# Altium project Power_Board_2.PrjPcb (part 4 of 4)

## Sheet External_Connections.SchDoc
size A4; SheetNumber: 10
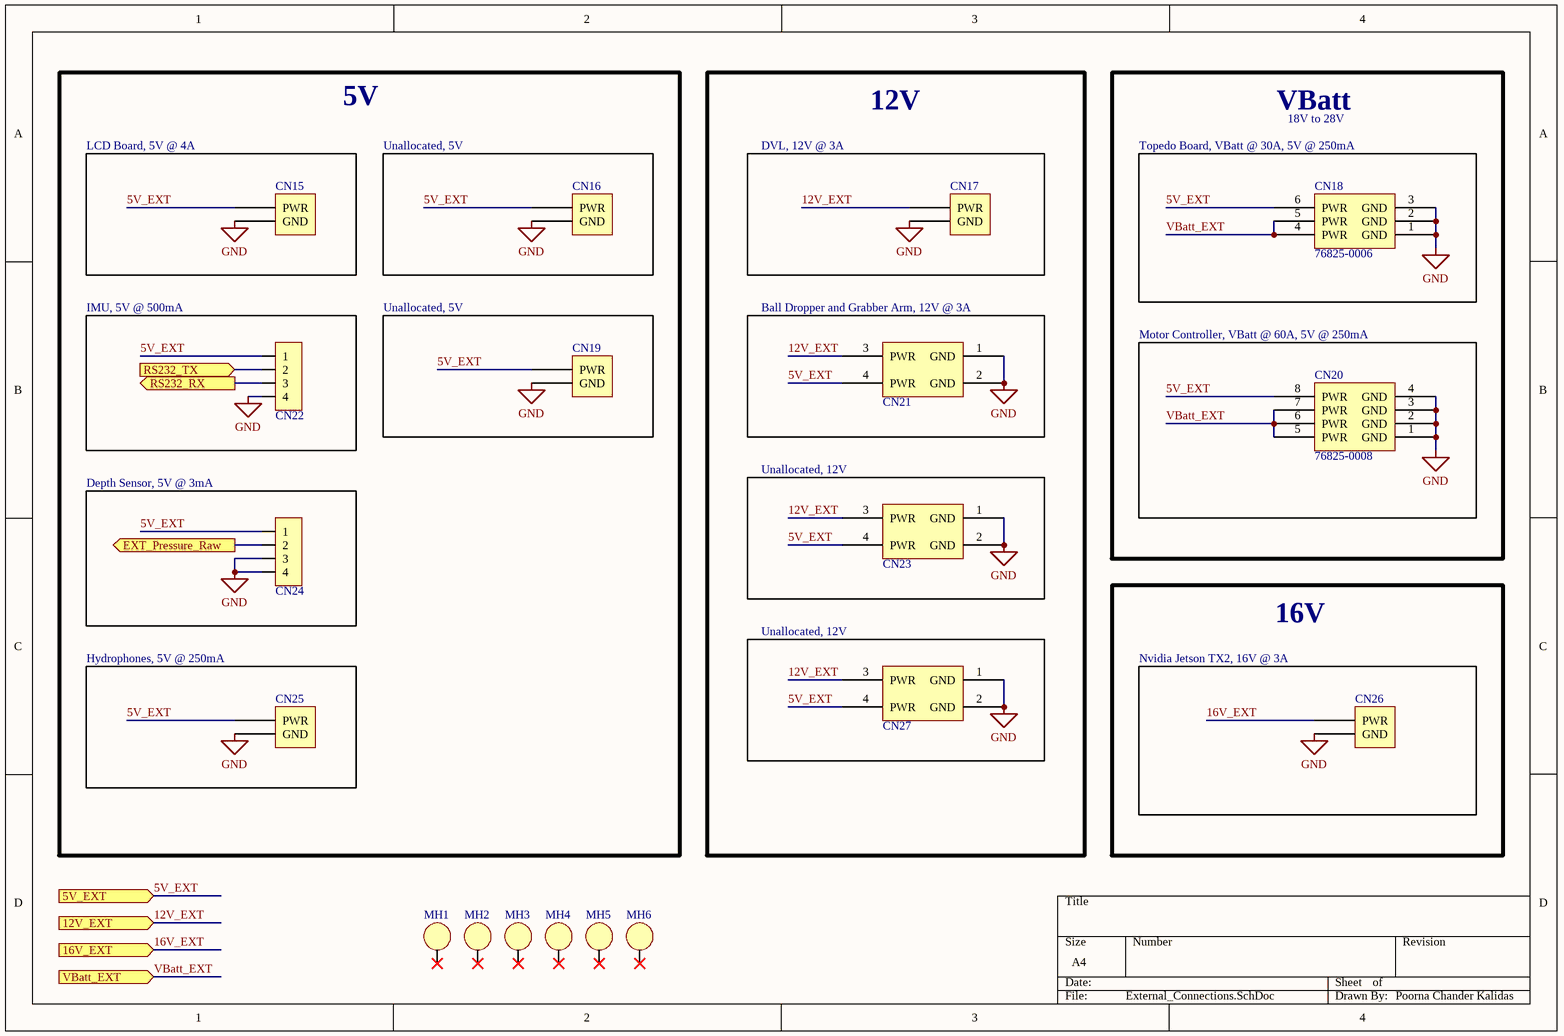
[diagram p9: External_Connections.SchDoc]

### Parts
CN15  Header, Female, 1x2, Right Angle, Pitch 0.118" (3.00mm), THT  [New footprint 1]  (value not drawn)
CN16  Header, Female, 1x2, Right Angle, Pitch 0.118" (3.00mm), THT  [New footprint 1]  (value not drawn)
CN17  Header, Female, 1x2, Right Angle, Pitch 0.118" (3.00mm), THT  [New footprint 1]  (value not drawn)
CN18  76825-0006  [76825-0006-Footprint-1]
CN19  Header, Female, 1x2, Right Angle, Pitch 0.118" (3.00mm), THT  [New footprint 1]  (value not drawn)
CN20  76825-0008  [76825-0008-Footprint-1]
CN21  Header, Female, 2x2, RIght Angle, Pitch: 0.118"  (3.00mm), THT  [2x2 Pitch 118mil connector]  (value not drawn)
CN22  Header, Male, 1x4, RA, Pitch 0.1" (2.54mm)  [HEADER, MALE, SHROUDED, 4x1, PITCH 0.1" (2.54mm), RA]  (value not drawn)
CN23  Header, Female, 2x2, RIght Angle, Pitch: 0.118"  (3.00mm), THT  [2x2 Pitch 118mil connector]  (value not drawn)
CN24  Header, Male, 1x4, RA, Pitch 0.1" (2.54mm)  [HEADER, MALE, SHROUDED, 4x1, PITCH 0.1" (2.54mm), RA]  (value not drawn)
CN25  Header, Female, 1x2, Right Angle, Pitch 0.118" (3.00mm), THT  [New footprint 1]  (value not drawn)
CN26  Header, Female, 1x2, Right Angle, Pitch 0.118" (3.00mm), THT  [New footprint 1]  (value not drawn)
CN27  Header, Female, 2x2, RIght Angle, Pitch: 0.118"  (3.00mm), THT  [2x2 Pitch 118mil connector]  (value not drawn)
MH1  Mount_Hole_3mm  [Mount-Hole_3mm]  (value not drawn)
MH2  Mount_Hole_3mm  [Mount-Hole_3mm]  (value not drawn)
MH3  Mount_Hole_3mm  [Mount-Hole_3mm]  (value not drawn)
MH4  Mount_Hole_3mm  [Mount-Hole_3mm]  (value not drawn)
MH5  Mount_Hole_3mm  [Mount-Hole_3mm]  (value not drawn)
MH6  Mount_Hole_3mm  [Mount-Hole_3mm]  (value not drawn)

### Blocks framed on the sheet
LCD Board, 5V @ 4A: CN15
Unallocated, 5V: CN16
DVL, 12V @ 3A: CN17
Topedo Board, VBatt @ 30A, 5V @ 250mA: CN18
IMU, 5V @ 500mA: CN22
Unallocated, 5V: CN19
Ball Dropper and Grabber Arm, 12V @ 3A: CN21
Motor Controller, VBatt @ 60A, 5V @ 250mA: CN20
Depth Sensor, 5V @ 3mA: CN24
Unallocated, 12V: CN23
Hydrophones, 5V @ 250mA: CN25
Unallocated, 12V: CN27
Nvidia Jetson TX2, 16V @ 3A: CN26

### Ports
5V_EXT (in), 12V_EXT (in), 16V_EXT (in), EXT_Pressure_Raw (out), RS232_RX (out), RS232_TX (in), VBatt_EXT (in)

### Nets
GND: CN15.1(GND) CN16.1(GND) CN17.1(GND) CN18.1(GND) CN18.2(GND) CN18.3(GND) CN19.1(GND) CN20.1(GND) CN20.2(GND) CN20.3(GND) CN20.4(GND) CN21.1(GND) CN21.2(GND) CN22.4 CN23.1(GND) CN23.2(GND) CN24.3 CN24.4 CN25.1(GND) CN26.1(GND) CN27.1(GND) CN27.2(GND)
5V_EXT: CN15.2(PWR) CN16.2(PWR) CN18.6(PWR) CN19.2(PWR) CN20.8(PWR) CN21.4(PWR) CN22.1 CN23.4(PWR) CN24.1 CN25.2(PWR) CN27.4(PWR) ; port 5V_EXT
12V_EXT: CN17.2(PWR) CN21.3(PWR) CN23.3(PWR) CN27.3(PWR) ; port 12V_EXT
16V_EXT: CN26.2(PWR) ; port 16V_EXT
EXT_Pressure_Raw: CN24.2 ; port EXT_Pressure_Raw
RS232_RX: CN22.3 ; port RS232_RX
RS232_TX: CN22.2 ; port RS232_TX
VBatt_EXT: CN18.4(PWR) CN18.5(PWR) CN20.5(PWR) CN20.6(PWR) CN20.7(PWR) ; port VBatt_EXT

Not connected (* = marked no-connect by the designer): MH1 1*; MH2 1*; MH3 1*; MH4 1*; MH5 1*; MH6 1*

### Notes on the sheet
- 5V
- 12V
- VBatt
- 18V to 28V
- 16V
- Poorna Chander Kalidas

### Library data of the parts
CN15-CN17 CN19 CN25 CN26 = CMP-00001-4: Connector Header Through Hole, Right Angle 2 position; Gender: Male; Max Voltage Rating (DC): 250.25kV; Number of Contacts: 2; Current Rating: 5A; Glow Wire Compliant: Compliant; Voltage Rating: 600V; Voltage Rating (DC): 250V; Insulation Resistance: 1GR; Pitch: 3mm; Contact Resistance: 10mR; Length: 7.15mm; Contact Material: Brass; Housing Color: Black; Contact Plating: Gold; Packaging: Tray; Mount: Through Hole; Diameter: 3mm; Housing Material: Thermoplastic; Case/Package: SMC; Depth: 12.2mm; Termination: Solder; Color: Black; Max Current Rating: 5A; Number of Positions: 2; Lead Free: Contains Lead; Min Operating Temperature: -40°C; Number of Rows: 2; Height: 8.77mm; Package Quantity: 3168; Number of Circuits: 2; Max Operating Temperature: 105°C; Radiation Hardening: No; Flammability Rating: UL94 V-0; Orientation: Right Angle; Halogen Free: Low Halogen
CN18 = CMP-00049-2: CONNECTOR, HEADER, 6POS, 2ROW, 5.7MM; Product Range:Mega-Fit 76825 Series; Contact Termination Type:Through Hole; Gender:Header; No. of Contacts:6; Pitch Spacing:5.7mm; Contact Plating:Tin Plated Contacts; Contact Material:Copper; Number of Circuits: 6; Gender: Male; Mount: Through Hole; Color: Black; Number of Rows: 2; Contact Material: Copper; Termination: Through Hole; Orientation: Right Angle; Number of Pins: 6; Pitch: 5.7mm; REACH SVHC: Unknown; Contact Plating: Tin; Number of Contacts: 6
CN20 = CMP-00051-3: MOLEX         76825-0008.             CONNECTOR, HEADER, 8POS, 2ROW, 5.7MM; Number of Circuits: 8; Gender: Male; Color: Black; Contact Material: Copper; Pitch: 5.7mm; Number of Rows: 2; Mount: Through Hole; Number of Contacts: 8; Number of Pins: 8; Orientation: Right Angle; Contact Plating: Tin; REACH SVHC: Unknown; Termination: Through Hole
CN21 CN23 CN27 = CMP-005-0021-4: Connector Header Through Hole, Right Angle 4 position 0.118" (3.00mm); Design Item ID: Header, Female, 2x2, RIght Angle, Pitch: 0.118"  (3.00mm), THT; Publisher: AUVic; Component Type: Standard; Created By: Poorna Chander Kalidas; Source: AUVic_Schematic_Library_Connectors.SchLib; Date Published: 2020-05-16; Pin Count: 4
CN22 CN24 = CMP-005-0029-3: Connector Header Through Hole, Right Angle 4 position 0.100" (2.54mm); Source: AUVic_Schematic_Library_Connectors.SchLib; Created On: 2020-05-20; Pin Count: 4; Component Type: Standard; Design Item ID: Header, Male, 1x4, RA, Pitch 0.1" (2.54mm); Created By: Miguel Manguerra
MH1-MH6 = CMP-004-0010-4: Mounting hold for M3 hex standoff; Source: AUVic_Schematic_Library_Connectors.SchLib; Design Item ID: Mount_Hole_3mm; Component Type: Standard; Pin Count: 1

## Nets that join several sheets
3V3: Battery_Management (7 pins), 5V_12V_External (6 pins), Micro (23 pins), Power_Internal (C57.2 R85.2 U14.2), Sensors (7 pins), Reed_Switch (5 pins), Communications (5 pins), 16V_VBatt_External (7 pins)
5V_INT: Micro (D17.K), Power_Internal (8 pins), Communications (C73.1 C74.1 U17.3)
GND: Battery_Management (33 pins), 5V_12V_External (45 pins), Micro (29 pins), Power_Internal (13 pins), Sensors (7 pins), Reed_Switch (19 pins), Communications (10 pins), 16V_VBatt_External (23 pins), External_Connections (22 pins)
Motor_PWR: Battery_Management (7 pins), Power_Internal (D10.A), 16V_VBatt_External (C52.1 Q7.5 Q8.5 U12.1)
System_PWR: Battery_Management (5 pins), 5V_12V_External (14 pins), Power_Internal (D9.A), 16V_VBatt_External (5 pins)
VBatt_INT: Battery_Management (C7.1 U4.1), Power_Internal (5 pins), Reed_Switch (CN11.1 Q10.2 SW2.4)
5V_EXT: 5V_12V_External (R45.1 R50.1 U6.8), External_Connections (11 pins)
12V_EXT: 5V_12V_External (R56.1 R61.1 U8.8), External_Connections (CN17.2 CN21.3 CN23.3 CN27.3)
16V_Enable: Micro (U16.12), 16V_VBatt_External (R71.2 U9.3)
16V_EXT: 16V_VBatt_External (R67.1 R70.1 U10.8), External_Connections (CN26.2)
ADC_Bat0_1: Battery_Management (R9.1 R19.2), Micro (U15.25)
ADC_Bat0_2: Battery_Management (R10.2 R20.2), Micro (U15.24)
ADC_Bat0_3: Battery_Management (R11.1 R21.2), Micro (U15.23)
ADC_Bat0_4: Battery_Management (R12.1 R22.1), Micro (U15.22)
ADC_Bat0_5: Battery_Management (R13.1 R23.2), Micro (U15.21)
ADC_Bat0_6: Battery_Management (R14.1 R24.2), Micro (U15.20)
ADC_Bat1_1: Battery_Management (R31.2 R37.2), Micro (U15.17)
ADC_Bat1_2: Battery_Management (R32.2 R38.2), Micro (U15.16)
ADC_Bat1_3: Battery_Management (R33.1 R39.2), Micro (U15.15)
ADC_Bat1_4: Battery_Management (R34.1 R40.1), Micro (U15.14)
ADC_Bat1_5: Battery_Management (R35.1 R41.2), Micro (U15.11)
ADC_Bat1_6: Battery_Management (R36.1 R42.2), Micro (U15.10)
CAN_RX: Micro (U15.61), Communications (JP2.2 R101.2)
CAN_TX: Micro (U15.62), Communications (JP2.1 R99.2)
EXT_Pressure_Raw: Sensors (R104.2), External_Connections (CN24.2)
I2C_SCL: Battery_Management (U1.2 U1.5 U2.5 U3.5), 5V_12V_External (U6.2 U6.5 U8.5), Micro (JP1.1 R95.1 U15.41), Sensors (U18.8 U19.6), 16V_VBatt_External (U10.5 U11.5)
I2C_SDA: Battery_Management (U1.4 U2.4 U3.2 U3.4), 5V_12V_External (U6.4 U8.2 U8.4), Micro (JP1.2 R96.1 U15.40), Sensors (U18.7 U19.1), 16V_VBatt_External (U10.4 U11.4)
NetC12_2: 5V_12V_External (C12.2 R44.2 U5.3), Micro (U16.14)
NetC29_2: 5V_12V_External (C29.2 R55.2 U7.3), Micro (U16.13)
NetCN7_2: Micro (U15.9), Sensors (CN7.2 R102.1)
NetD18_A: Micro (U15.8), Sensors (D18.A D19.K R104.1)
NetQ10_3: Power_Internal (U13.4), Reed_Switch (Q10.3 R113.1)
NetQ12_3: Micro (U15.52), Reed_Switch (Q12.3 R111.1)
NetQ13_3: Micro (U15.56), Reed_Switch (Q13.3 R120.1)
NetQ14_3: Micro (U15.57), Reed_Switch (Q14.3 R121.1)
NetQ15_3: Micro (U15.58), Reed_Switch (Q15.3 R122.2)
NetR27_1: Battery_Management (R27.1 R30.2 U4.2), Micro (U15.28)
NetR80_1: Micro (U16.15), 16V_VBatt_External (R80.1 U12.2)
NetR98_1: Micro (U15.29), Communications (R98.1 U17.8)
NetR108_2: Micro (U15.51), Reed_Switch (R108.2)
NetU1_3: Battery_Management (U1.3), Micro (U15.50)
NetU2_3: Battery_Management (U2.3), Micro (U15.42)
NetU3_3: Battery_Management (U3.3), Micro (U15.43)
NetU6_3: 5V_12V_External (U6.3), Micro (U15.37)
NetU8_3: 5V_12V_External (U8.3), Micro (U15.38)
NetU10_3: Micro (U15.39), 16V_VBatt_External (U10.3)
NetU11_3: Micro (U15.27), 16V_VBatt_External (U11.3)
RS232_RX: Communications (U20.13), External_Connections (CN22.3)
RS232_TX: Communications (U20.14), External_Connections (CN22.2)
UART_RX: Micro (U15.33), Communications (JP4.1 U20.12)
UART_TX: Micro (U15.34), Communications (JP4.2 U20.11)
VBatt_EXT: 16V_VBatt_External (R74.1 R77.1 U11.8), External_Connections (5 pins)